# Altium schematic sheet DIPBreakout.SchDoc
size A; SheetNumber: 3; SheetTotal: 4
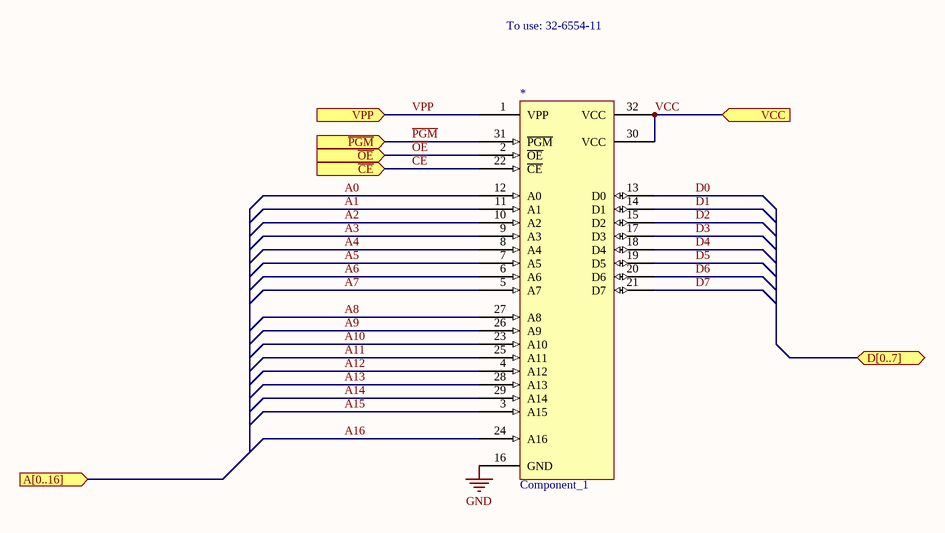
[diagram p0: DIPBreakout.SchDoc]

## Parts
*  Component_1  [PCBComponent_1]

## Ports
A[0..16] (in), D[0..7] (bidir), VCC (in), VPP (in), ~{CE} (in), ~{OE} (in), ~{PGM} (in)

## Nets
GND: *.16(GND)
A0: *.12(A0)
A1: *.11(A1)
A2: *.10(A2)
A3: *.9(A3)
A4: *.8(A4)
A5: *.7(A5)
A6: *.6(A6)
A7: *.5(A7)
A8: *.27(A8)
A9: *.26(A9)
A10: *.23(A10)
A11: *.25(A11)
A12: *.4(A12)
A13: *.28(A13)
A14: *.29(A14)
A15: *.3(A15)
A16: *.24(A16)
~{CE}: *.22(~{CE}) ; port ~{CE}
D0: *.13(D0)
D1: *.14(D1)
D2: *.15(D2)
D3: *.17(D3)
D4: *.18(D4)
D5: *.19(D5)
D6: *.20(D6)
D7: *.21(D7)
~{OE}: *.2(~{OE}) ; port ~{OE}
~{PGM}: *.31(~{PGM}) ; port ~{PGM}
VCC: *.30(VCC) *.32(VCC) ; port VCC
VPP: *.1(VPP) ; port VPP

## Notes on the sheet
- To use: 32-6554-11